# Altium schematic sheet Power.SchDoc
size 431 x 279 mm; Organization: ORGANIZATION; Address1: ADDRESS 1; Address2: ADDRESS 2; Address3: ADDRESS 3; Address4: ADDRESS 4; Revision: -; SheetNumber: 5; SheetTotal: 6; ENG_APP_DATE: --/--/--; DSN_APP_DATE: --/--/--; CHK_APP_DATE: --/--/--
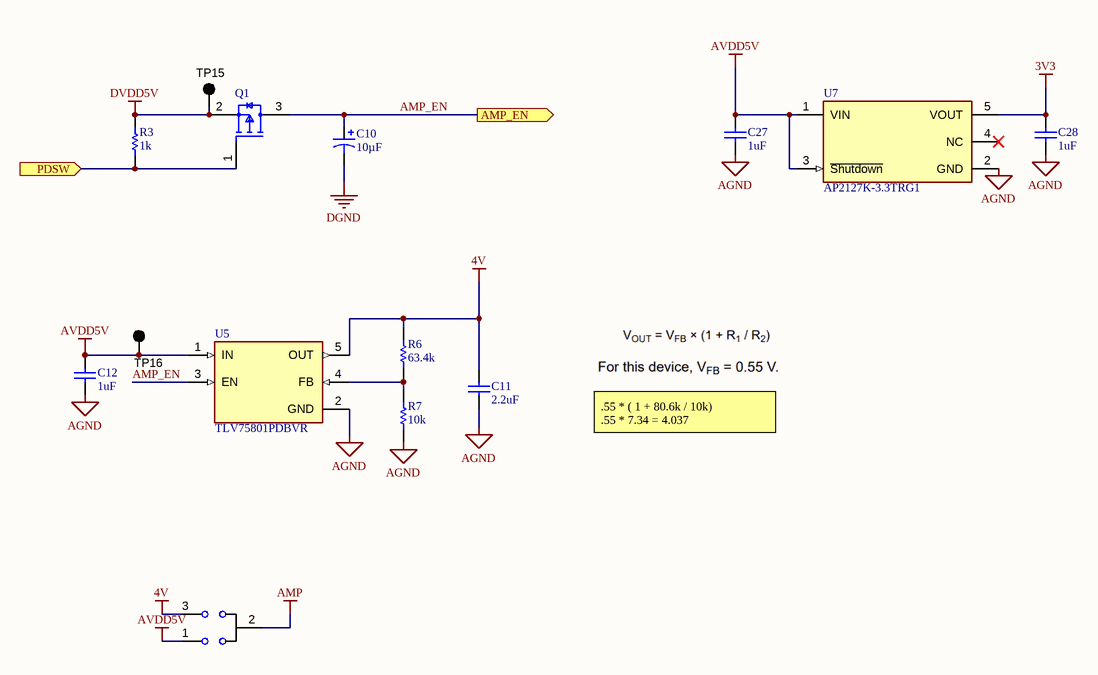
[diagram p0: Power.SchDoc]

## Parts
C10  10µF  [1206 TANT CASE A]
C11  2.2uF  [0603]
C12  1uF  [0603]
C27  1uF  [0603]
C28  1uF  [0603]
JP1  2 way jumper  [0603 2 way jumper]  (value not drawn)
Q1  DMG2301L-7  [FP-SOT23-MFG]  (value not drawn)
R3  1k  [0603]
R6  63.4k  [0603]
R7  10k  [0603]
TP15  5001  [Testpoint pad]  (value not drawn)
TP16  5001  [Testpoint pad]  (value not drawn)
U5  TLV75801PDBVR  [SOT95P280X145-5N]
U7  AP2127K-3.3TRG1  [FP-SOT25-MFG]

## Ports
AMP_EN (out, see Top Level[5E], AB Amplifier[6D]), PDSW (in, see Top Level[5E], CM6206[7E])

## Nets
3V3: C28.2 U7.5(VOUT)
4V: C11.2 JP1.3 R6.2 U5.5(OUT)
AGND: C11.1 C12.1 C27.1 C28.1 R7.1 U5.2(GND) U7.2(GND)
AMP: JP1.2
AVDD5V: C12.2 C27.2 JP1.1 TP16.1 U5.1(IN) U7.1(VIN) U7.3(~{Shutdown})
DGND: C10.1
DVDD5V: Q1.2(S) R3.2 TP15.1
AMP_EN: C10.2 Q1.3(D) U5.3(EN) ; port AMP_EN
PDSW: Q1.1(G) R3.1 ; port PDSW
NetR6_1: R6.1 R7.2 U5.4(FB)

Not connected (* = marked no-connect by the designer): U7 4(NC)*

## Notes on the sheet
- .55 * ( 1 + 80.6k / 10k)
  .55 * 7.34 = 4.037
- DWG. NO.
- REV.
- SHT.
- THIS DOCUMENT AND THE DATA DISCLOSED HEREIN OR HEREWITH IS THE PROPERTY OF ALTIUM LIMITED AND MAY BE FREELY DISTRIBUTED IN WHOLE. NO RIGHTS ARE RESERVED OR EXPRESS OR IMPLIED WARANTEE GIVEN.
- REVISION
- DESCRIPTION
- DATE
- APPROVED
- ENG:
- APPROVALS
- PROJECT
- DSN:
- CHK:
- REFERENCE DOCUMENTS
- PROJECT REVISION:
- TITLE
- DOCUMENT REVISION:
- DESIGN ITEM:
- BOM:
- FAB DWG:
- PCB DWG:
- ASSY DWG:
- SCALE:
- SIZE
- B
- CAGE CODE
- FILE NAME
- DWG NO.
- SHEET
- OF
- REV

## Library data of the parts
C10 = T491A106M016AT: CAP TANT 10UF 16V 20% 1206; Manufacturer Size Code: A; Manufacturer: Kemet; ESR (Equivalent Series Resistance): 7 Ohm; Type: Molded; Lifetime @ Temp.: 2000 Hrs @ 85°C; Packaging: Cut Tape (CT); Capacitance: 10µF; Tolerance: ±20%; Voltage - Rated: 16V; Operating Temperature: -55°C ~ 125°C; Mounting Type: Surface Mount; Package / Case: 1206 (3216 Metric); Size / Dimension: 0.126" L x 0.063" W (3.20mm x 1.60mm); Height - Seated (Max): 0.071" (1.80mm); Lead Spacing: -; Features: General Purpose; ComponentLink1URL: http://www.kemet.com/Lists/ProductCatalog/Attachments/254/KEM_T2005_T491.pdf; ComponentLink1Description: http://www.kemet.com/Lists/ProductCatalog/Attachments/254/KEM_T2005_T491.pdf; Supplier 1: Digi-Key; Supplier Part Number 1: 399-3687-1-ND; Manufacturer Part Number: T491A106M016AT; RoHS: RoHS Compliant; Category: Capacitors; Stock: 136950; Pricing: 1=0.41, 10=0.362, 50=0.2198, 100=0.181, 250=0.14476, 500=0.13184, 1000=0.11891 (USD)
C11 C12 C27 C28 = C TBD 0603
Q1 = CMP-12801-000065-1: MOSFET P-CH 20V 3A SOT23; Manufacturer: Diodes Inc.; Number Of Channels: 1; Turn On Delay Time: 5ns; Drain To Source Resistance: 120mΩ; Max Junction Temp: +150°C; Gate To Source Voltage: 8V; Power Dissipation: 1.5W; Rthja Max: 83°C/W; Max Forward Diode Voltage: -1.2V; Standoff Height: 0.013mm; Threshold Vgs Min: -0.4V; Input Capacitace At Vds: 476pF @ -10V; Depletion Mode: False; Gate Charge At Vgs: 5.5nC @ -4.5V; Pulse Drain Current: -10A; Drain To Source Voltage: -20V; Continuous Drain Current: -3A; Turn Off Delay Time: 30ns; Lead Free: Yes; Package: SOT23; ComponentLink2Description: Datasheet; Device Class L3: MOSFETs; Device Class L1: Discrete Semiconductors; Manufacturer Part Number: DMG2301L-7; Automotive: No; Height: 1.1mm; Category: Trans; Temperature Range High: +150°C; Digikey Description: MOSFET P-CH 20V 3A SOT23; RoHS: TRUE; Number Of P Channels: 1; Footprint Url: https://www.diodes.com/assets/Package-Files/SOT23.pdf; Octopart: https://octopart.com/dmg2301l-7-diodes+inc.-67250456; ComponentLink2URL: https://www.diodes.com/assets/Datasheets/DMG2301L.pdf; Mouser Description: Single P-Channel 20 V 1.5 W 5.5 nC Silicon Surface Mount Mosfet - SOT-23; Drain To Source Breakdown Voltage: -20V; Threshold Vgs Max: -1.2V; Device Class L2: Transistors; Temperature: -55°C to +150°C; Temperature Range Low: -55°C
R3 R6 R7 = R TBD 0603
TP15 TP16 = 5001: TEST POINT PC MINI .040"D BLACK; Manufacturer: Keystone Electronics; Packaging: Bulk; Type: PC Test Point, Miniature; Terminal: 0.010" x 0.020" (0.25mm x 0.51mm) Phosphor Bronze Wire, Silver Plated; Mounting Type: 0.040" (1.02mm) Hole Diameter; Material: Base, Nylon 46, UL 94V-0; Color: Black; ComponentLink1URL: http://www.keyelco.com/product-pdf.cfm?p=1310; ComponentLink1Description: http://www.keyelco.com/product-pdf.cfm?p=1310; Supplier 1: Digi-Key; Supplier Part Number 1: 36-5001-ND; Manufacturer Part Number: 5001; RoHS: RoHS Compliant; Category: Test and Measurement; Stock: 443864; Pricing: 1=0.36, 10=0.327, 50=0.238, 100=0.2286, 250=0.20528, 500=0.19594, 1000=0.16328, 2500=0.14928, 5000=0.13995 (USD)
U5 = TLV75801PDBVR: 500-mA, low-IQ, high-accuracy, adjustable ultra-low-dropout voltage regulator with enable; MF: Texas Instruments; SnapEDA_Link: https://www.snapeda.com/parts/TLV75801PDBVR/Texas+Instruments/view-part/?ref=snap; Package: SOT-23-5 Texas Instruments; Value: *; MP: TLV75801PDBVR; Check_prices: https://www.snapeda.com/parts/TLV75801PDBVR/Texas+Instruments/view-part/?ref=eda
U7 = CMP-12756-000001-1: IC REG LINEAR 3.3V 300MA SOT23-5; Manufacturer: Diodes Inc.; Output Type: Fixed; Max Junction Temp: +150°C; Max Supply Voltage: 6V; Nominal Supply Current: 60uA; Standoff Height: 0.013mm; Min Supply Voltage: 2.5V; Dropout Voltage: 170mV; Number Of Outputs: 1; Accuracy Percentage: 2%; Output Current: 400mA; Temperature Range Low: -40°C; Octopart: https://octopart.com/ap2127k-3.3trg1-diodes+inc.-30954597; Automotive: No; Mouser Description: LDO Voltage Regulators 300mA CMOS LDO 2.5V to 6V; Device Class L3: Voltage Regulators - Linear; Height: 1.4mm; Ambient Temperature Range Low: -40°C; Output Voltage: 3.3V; ComponentLink2Description: Datasheet; RoHS: TRUE; Digikey Description: IC REG LINEAR 3.3V 300MA SOT23-5; Device Class L1: Integrated Circuits (ICs); Device Class L2: Power Management ICs; Footprint Url: https://www.diodes.com/assets/Package-Files/SOT25.pdf; Temperature: -40°C to +85°C; Category: IC; Lead Free: Yes; Temperature Range High: +85°C; Manufacturer Part Number: AP2127K-3.3TRG1; Ambient Temperature Range High: +85°C; Package: SOT25; ComponentLink2URL: https://www.diodes.com/assets/Datasheets/AP2127.pdf